# EAGLE design yamaHACK (EAGLE 8.2.1)
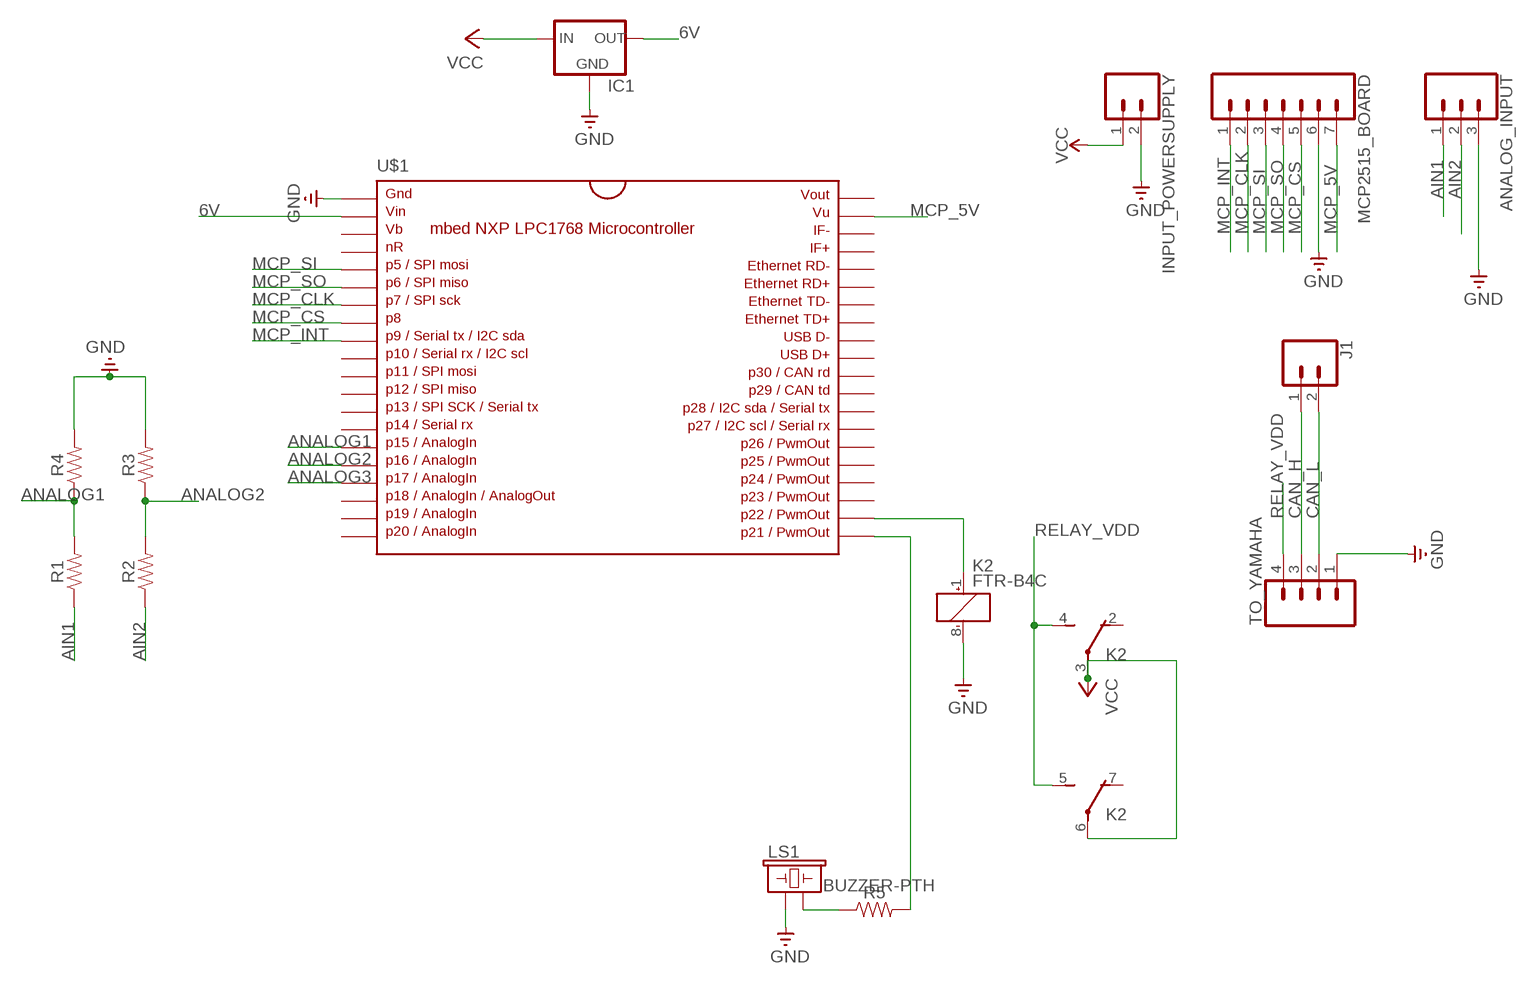
[diagram p0: schematic, sheet 1]

## Parts
ANALOG_INPUT  CONN_03LONGPADS  [1X03_LONGPADS]
IC1  78MXXS  [78MXXS]
INPUT_POWERSUPPLY  CONN_02PTH3  [1X02_LONGPADS]
J1  CONN_02  [1X02]
K2  FTR-B4C  [FTR-B4C]
LS1  BUZZER-PTH  [BUZZER-12MM]
MCP2515_BOARD  CONN_07LONGPADS  [1X07_LONGPADS]
R1  RESISTORAXIAL-0.3  [AXIAL-0.3]
R2  RESISTORAXIAL-0.3  [AXIAL-0.3]
R3  RESISTORAXIAL-0.3  [AXIAL-0.3]
R4  RESISTORAXIAL-0.3  [AXIAL-0.3]
R5  RESISTORAXIAL-0.3  [AXIAL-0.3]
TO_YAMAHA  CONN_04  [1X04]
U$1  MBED1768  MBED_NXP_LPC1768  [DIL40_0.9]

## Nets
6V: IC1.OUT U$1.2
AIN1: ANALOG_INPUT.1 R1.P$1
AIN2: ANALOG_INPUT.2 R2.P$1
ANALOG1: R1.P$2 R4.P$1 U$1.15
ANALOG2: R2.P$2 R3.P$1 U$1.16
ANALOG3: U$1.17
CAN_H: J1.1 TO_YAMAHA.3
CAN_L: J1.2 TO_YAMAHA.2
GND: ANALOG_INPUT.3 IC1.GND INPUT_POWERSUPPLY.2 K2.8(K:-) LS1.+ MCP2515_BOARD.6 R3.P$2 R4.P$2 TO_YAMAHA.1 U$1.1
MCP_5V: MCP2515_BOARD.7 U$1.39
MCP_CLK: MCP2515_BOARD.2 U$1.7
MCP_CS: MCP2515_BOARD.5 U$1.8
MCP_INT: MCP2515_BOARD.1 U$1.9
MCP_SI: MCP2515_BOARD.3 U$1.5
MCP_SO: MCP2515_BOARD.4 U$1.6
N$1: LS1.- R5.P$1
N$2: R5.P$2 U$1.21
N$13: K2.1(K:+) U$1.22
RELAY_VDD: K2.4(-1:S) K2.5(-2:S) TO_YAMAHA.4
VCC: IC1.IN INPUT_POWERSUPPLY.1 K2.3(-1:P) K2.6(-2:P)
Unconnected: K2.2(-1:O) K2.7(-2:O) U$1.3 U$1.4 U$1.10 U$1.11 U$1.12 U$1.13 U$1.14 U$1.18 U$1.19 U$1.20 U$1.23 U$1.24 U$1.25 U$1.26 U$1.27 U$1.28 U$1.29 U$1.30 U$1.31 U$1.32 U$1.33 U$1.34 U$1.35 U$1.36 U$1.37 U$1.38 U$1.40

## Library data of the parts
ANALOG_INPUT = SparkFun-Connectors:CONN_03: Multi connection point. Often used as Generic Header-pin footprint for 0.1 inch spaced/style header connections On any of the 0.1 inch spaced packages, you can populate with these: Break Away Headers - Straight <https://www.sparkfun.com/products/116> (PRT-00116) Break Away Male Headers - Right Angle <https://www.sparkfun.com/products/553> (PRT-00553) Female Headers <https://www.sparkfun.com/products/115> (PRT-00115) Break Away Headers - Machine Pin <https://www.sparkfun.com/products/117> (PRT-00117) Break Away Female Headers - Swiss Machine Pin <https://www.sparkfun.com/products/743> (PRT-00743) Stackable Header - 3 Pin (Female, 0.1") <https://www.sparkfun.com/products/13875> (PRT-13875) For SCREWTERMINALS and SPRING TERMINALS visit here: Screw Terimnals on SparkFun.com <https://www.sparkfun.com/search/results?term=Screw+Terminals> (5mm/3.5mm/2.54mm spacing) This device is also useful as a general connection point to wire up your design to another part of your project. Our various solder wires solder well into these plated through hole pads. Hook-Up Wire - Assortment (Stranded, 22 AWG) <https://www.sparkfun.com/products/11375> (PRT-11375) Hook-Up Wire - Assortment (Solid Core, 22 AWG) <https://www.sparkfun.com/products/11367> (PRT-11367) View the entire wire category on our website here <https://www.sparkfun.com/categories/141> Special notes: Molex polarized connector foot print use with SKU : PRT-08232 with associated crimp pins and housings.
IC1 = v-reg:78MXXS: VOLTAGE REGULATOR
INPUT_POWERSUPPLY J1 = SparkFun-Connectors:CONN_02: Multi connection point. Often used as Generic Header-pin footprint for 0.1 inch spaced/style header connections On any of the 0.1 inch spaced packages, you can populate with these: Break Away Headers - Straight <https://www.sparkfun.com/products/116> (PRT-00116) Break Away Male Headers - Right Angle <https://www.sparkfun.com/products/553> (PRT-00553) Female Headers <https://www.sparkfun.com/products/115> (PRT-00115) Break Away Headers - Machine Pin <https://www.sparkfun.com/products/117> (PRT-00117) Break Away Female Headers - Swiss Machine Pin <https://www.sparkfun.com/products/743> (PRT-00743) For SCREWTERMINALS and SPRING TERMINALS visit here: Screw Terimnals on SparkFun.com <https://www.sparkfun.com/search/results?term=Screw+Terminals> (5mm/3.5mm/2.54mm spacing) This device is also useful as a general connection point to wire up your design to another part of your project. Our various solder wires solder well into these plated through hole pads. Hook-Up Wire - Assortment (Stranded, 22 AWG) <https://www.sparkfun.com/products/11375> (PRT-11375) Hook-Up Wire - Assortment (Solid Core, 22 AWG) <https://www.sparkfun.com/products/11367> (PRT-11367) View the entire wire category on our website here <https://www.sparkfun.com/categories/141> Special notes: Molex polarized connector foot print use with: PRT-08233 with associated crimp pins and housings. 2.54_SCREWTERM for use with PRT-10571. 3.5mm Screw Terminal footprints for PRT-08084 5mm Screw Terminal footprints for use with PRT-08432
K2 = relay:FTR-B4: ULTRA MINIATURE RELAY 2 POLES - 2 A (Slim Profile Signal Relay) FUJITSU FTR-B4 SERIES Source: FTR-B4.pdf
LS1 = SparkFun-Electromechanical:BUZZER: Buzzer Small round buzzers that operate around the audible 2kHz range. You can use these as speakers to create simple music or user interfaces. Variant Overview: PTH - Mini Speaker - PC Mount 12mm 2.048kHz <https://www.sparkfun.com/products/7950> PTH_KIT - Mini Speaker - PC Mount 12mm 2.048kHz <https://www.sparkfun.com/products/7950> KIT simplifies soldering by adding stop mask to one side of the pads. PTH_NO_SILK - Mini Speaker - PC Mount 12mm 2.048kHz <https://www.sparkfun.com/products/7950> No silkscreen indicator of buzzer outline. PTH_KIT_NO_SILK - Mini Speaker - PC Mount 12mm 2.048kHz <https://www.sparkfun.com/products/7950> KIT package w/o silkscreen SMD - Buzzer Audio Magnetic (CCV-084B16) SMD buzzer used on, e.g. the LilyPad Buzzer <https://www.sparkfun.com/products/8463> and RFID USB Reader <https://www.sparkfun.com/products/9963>. SMD_KIT - Buzzer Audio Magnetic (CCV-084B16) SMD Buzzer with elongated pins to make soldering easier. Used on the SparkFun Simon Says - Surface Mount Soldering Kit <https://www.sparkfun.com/products/10935>.; PROD_ID: COMP-08253; SF_SKU: COM-07950
MCP2515_BOARD = SparkFun-Connectors:CONN_07: Multi connection point. Often used as Generic Header-pin footprint for 0.1 inch spaced/style header connections On any of the 0.1 inch spaced packages, you can populate with these: Break Away Headers - Straight <https://www.sparkfun.com/products/116> (PRT-00116) Break Away Male Headers - Right Angle <https://www.sparkfun.com/products/553> (PRT-00553) Female Headers <https://www.sparkfun.com/products/115> (PRT-00115) Break Away Headers - Machine Pin <https://www.sparkfun.com/products/117> (PRT-00117) Break Away Female Headers - Swiss Machine Pin <https://www.sparkfun.com/products/743> (PRT-00743) For SCREWTERMINALS and SPRING TERMINALS visit here: Screw Terimnals on SparkFun.com <https://www.sparkfun.com/search/results?term=Screw+Terminals> (5mm/3.5mm/2.54mm spacing) This device is also useful as a general connection point to wire up your design to another part of your project. Our various solder wires solder well into these plated through hole pads. Hook-Up Wire - Assortment (Stranded, 22 AWG) <https://www.sparkfun.com/products/11375> (PRT-11375) Hook-Up Wire - Assortment (Solid Core, 22 AWG) <https://www.sparkfun.com/products/11367> (PRT-11367) View the entire wire category on our website here <https://www.sparkfun.com/categories/141> Special notes: Molex polarized connector foot print use with SKU : PRT-08231 with associated crimp pins and housings. 1MM SMD Version SKU: PRT-10208 NOTES ON THE VARIANTS LOCK and LOCK_LONGPADS... This footprint was designed to help hold the alignment of a through-hole component (i.e. 6-pin header) while soldering it into place. You may notice that each hole has been shifted either up or down by 0.005 of an inch from it's more standard position (which is a perfectly straight line). This slight alteration caused the pins (the squares in the middle) to touch the edges of the holes. Because they are alternating, it causes a "brace" to hold the component in place. 0.005 has proven to be the perfect amount of "off-center" position when using our standard breakaway headers. Although looks a little odd when you look at the bare footprint, once you have a header in there, the alteration is very hard to notice. Also,if you push a header all the way into place, it is covered up entirely on the bottom side.
R1-R5 = SparkFun-Resistors:RESISTOR: Generic Resistor Package
TO_YAMAHA = SparkFun-Connectors:CONN_04: Multi connection point. Often used as Generic Header-pin footprint for 0.1 inch spaced/style header connections On any of the 0.1 inch spaced packages, you can populate with these: Break Away Headers - Straight <https://www.sparkfun.com/products/116> (PRT-00116) Break Away Male Headers - Right Angle <https://www.sparkfun.com/products/553> (PRT-00553) Female Headers <https://www.sparkfun.com/products/115> (PRT-00115) Break Away Headers - Machine Pin <https://www.sparkfun.com/products/117> (PRT-00117) Break Away Female Headers - Swiss Machine Pin <https://www.sparkfun.com/products/743> (PRT-00743) For SCREWTERMINALS and SPRING TERMINALS visit here: Screw Terimnals on SparkFun.com <https://www.sparkfun.com/search/results?term=Screw+Terminals> (5mm/3.5mm/2.54mm spacing) This device is also useful as a general connection point to wire up your design to another part of your project. Our various solder wires solder well into these plated through hole pads. Hook-Up Wire - Assortment (Stranded, 22 AWG) <https://www.sparkfun.com/products/11375> (PRT-11375) Hook-Up Wire - Assortment (Solid Core, 22 AWG) <https://www.sparkfun.com/products/11367> (PRT-11367) View the entire wire category on our website here <https://www.sparkfun.com/categories/141> Special notes: Molex polarized connector foot print use with SKU : PRT-08231 with associated crimp pins and housings. 1MM SMD Version SKU: PRT-10208; PROD_ID: CONN-09696
U$1 = SparkFun-Boards:MBED_NXP_LPC1768: mbed LPC1768 board footprint Boards using this footprint: mbed - LPC1768 (Cortex-M3) (DEV-09564); PROD_ID: COMP-12167

## Board
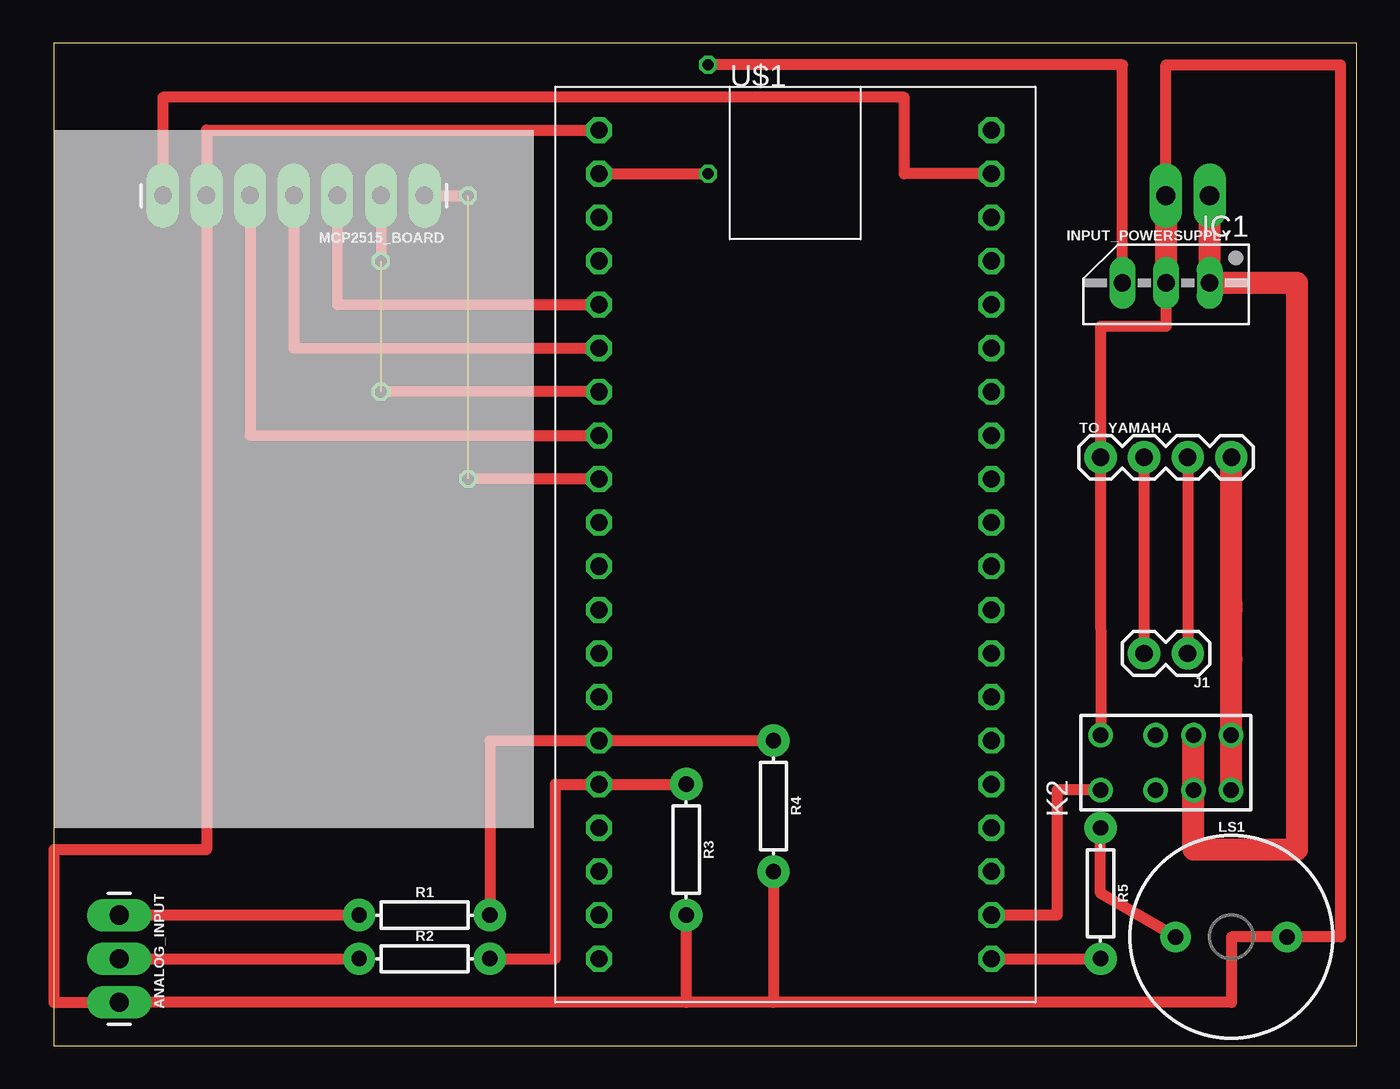
[diagram p1: board, top side]
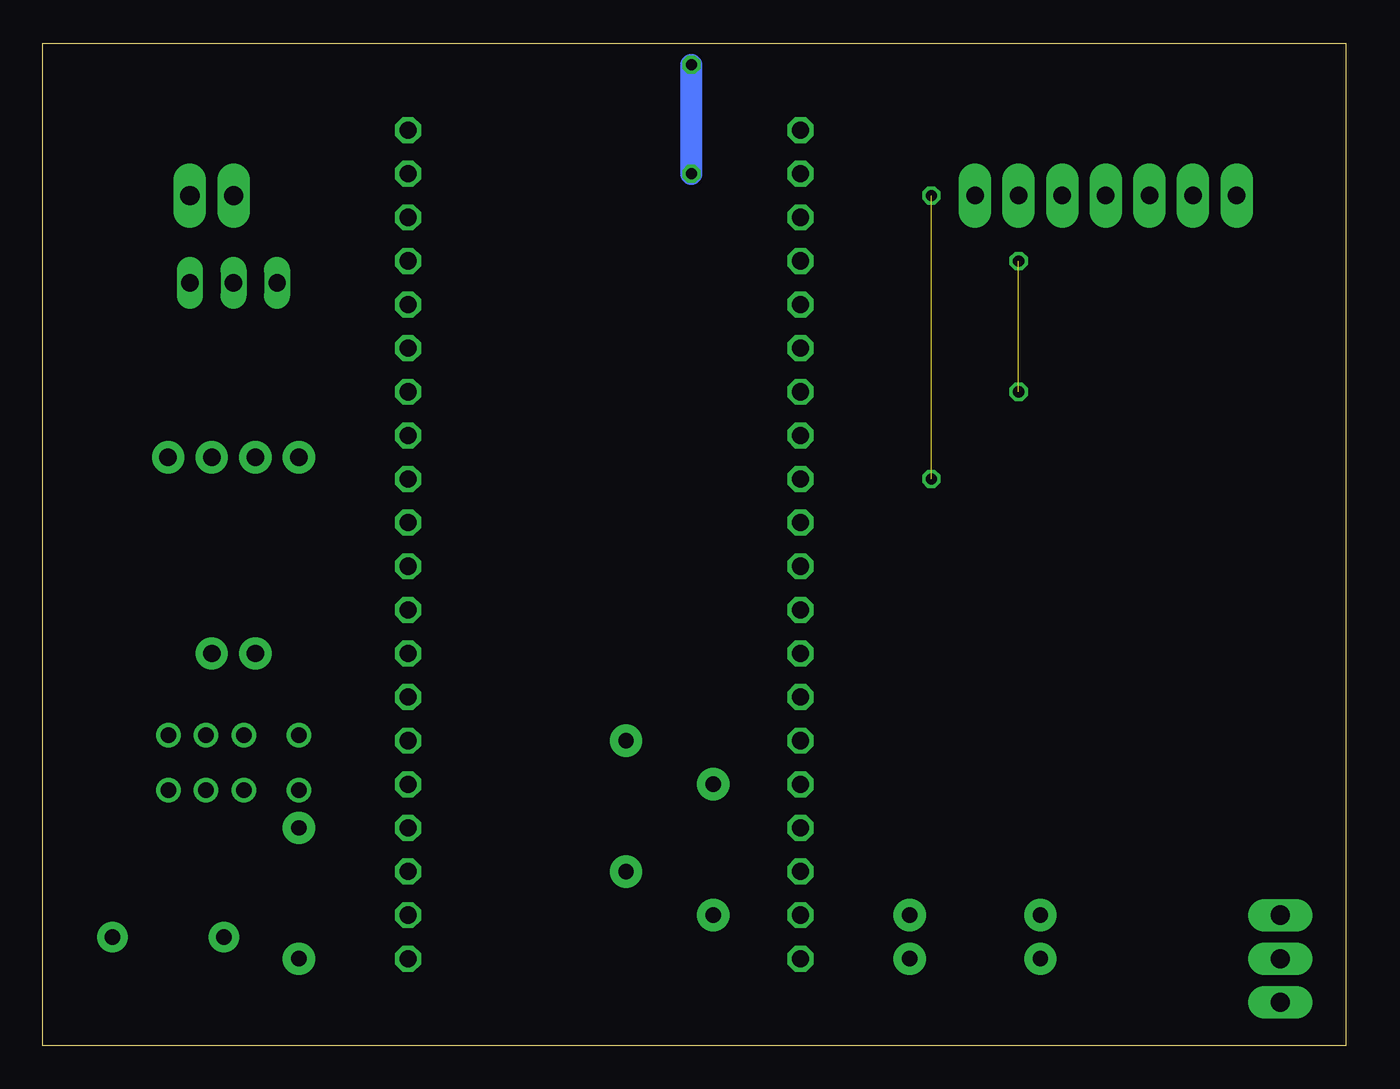
[diagram p2: board, bottom side, seen from below]

Size 75.87 x 58.41 mm. Coordinates in mm from the lower left corner, seen from the top.
Outline: 0,0 75.87,0 75.87,58.41 0,58.41 0,0
Copper layers (1*16): Top 0.035mm / dielectric 1.5mm / Bottom 0.035mm
Design rules "default": minimum track width 6mil, minimum drill 0.35mm, track to track 6mil, track to pad 6mil, pad to pad 6mil, via to via 6mil, smd to smd 6mil, copper to edge 40mil, drill to drill 6mil, minimum pad ring 10mil, minimum via ring 8mil, stop-mask expansion 4mil, vias tented up to drill 0mil, thermal gap 10mil

### Footprints (pad centres in the part's own frame; a part is rotated, then mirrored left to right if it is on the bottom)
1X03_LONGPADS = drill 1.118 pad 1.88 long: 1 0,0; 2 2.54,0; 3 5.08,0
78MXXS = drill 1.016 long: GND 0,-2.54; IN -2.54,-2.54; OUT 2.54,-2.54
1X02_LONGPADS = drill 1.118 pad 1.88 long: 1 0,0; 2 2.54,0
1X02 = drill 1.016 pad 1.88: 1 0,0; 2 2.54,0
FTR-B4C = drill 0.9 pad 1.422: 1 -3.8,-1.6; 2 -0.6,-1.6; 3 1.6,-1.6; 4 3.8,-1.6; 5 3.8,1.6; 6 1.6,1.6; 7 -0.6,1.6; 8 -3.8,1.6
BUZZER-12MM = drill 0.9 pad 1.778: + 3.25,0; - -3.25,0
1X07_LONGPADS = drill 1.016 pad 1.88 long: 1 0,0; 2 2.54,0; 3 5.08,0; 4 7.62,0; 5 10.16,0; 6 12.7,0; 7 15.24,0
AXIAL-0.3 = drill 0.9 pad 1.88: P$1 -3.81,0; P$2 3.81,0
1X04 = drill 1.016 pad 1.88: 1 0,0; 2 2.54,0; 3 5.08,0; 4 7.62,0
DIL40_0.9 = drill 1 pad 1.397 octagon: 1 -22.86,-11.43; 2 -20.32,-11.43; 3 -17.78,-11.43; 4 -15.24,-11.43; 5 -12.7,-11.43; 6 -10.16,-11.43; 7 -7.62,-11.43; 8 -5.08,-11.43; 9 -2.54,-11.43; 10 0,-11.43; 11 2.54,-11.43; 12 5.08,-11.43; 13 7.62,-11.43; 14 10.16,-11.43; 15 12.7,-11.43; 16 15.24,-11.43; 17 17.78,-11.43; 18 20.32,-11.43; 19 22.86,-11.43; 20 25.4,-11.43; 21 25.4,11.43; 22 22.86,11.43; 23 20.32,11.43; 24 17.78,11.43; 25 15.24,11.43; 26 12.7,11.43; 27 10.16,11.43; 28 7.62,11.43; 29 5.08,11.43; 30 2.54,11.43; 31 0,11.43; 32 -2.54,11.43; 33 -5.08,11.43; 34 -7.62,11.43; 35 -10.16,11.43; 36 -12.7,11.43; 37 -15.24,11.43; 38 -17.78,11.43; 39 -20.32,11.43; 40 -22.86,11.43

### Placement (x,y rotation side)
ANALOG_INPUT  3.81,7.62 270 top
IC1  64.77,41.91 180 top
INPUT_POWERSUPPLY  67.31,49.53 180 top
J1  66.04,22.86 180 top
K2  64.77,16.51 0 top
LS1  68.58,6.35 0 top
MCP2515_BOARD  21.59,49.53 180 top
R1  21.59,7.62 0 top
R2  21.59,5.08 0 top
R3  36.83,11.43 270 top
R4  41.91,13.97 270 top
R5  60.96,8.89 270 top
TO_YAMAHA  60.96,34.29 0 top
U$1  43.18,30.48 270 top

### Tracks (layer width: path | path; a pad name or v marks a point on that pad's centre or on a via)
6V  (via drill 0.65 pad 0.55)
  Top 0.635: IC1.OUT 62.23,57.15 v38.1,57.15 | U$1.2 v38.1,50.8
  Bottom 1.27: v38.1,50.8 v38.1,57.15
AIN1
  Top 0.635: R1.P$1 ANALOG_INPUT.1
AIN2
  Top 0.635: ANALOG_INPUT.2 R2.P$1
ANALOG1
  Top 0.635: R4.P$1 U$1.15 25.4,17.78 R1.P$2
ANALOG2
  Top 0.635: R3.P$1 U$1.16 29.21,15.24 29.21,5.08 R2.P$2
CAN_H
  Top 0.635: TO_YAMAHA.3 J1.1
CAN_L
  Top 0.635: J1.2 TO_YAMAHA.2
GND
  Top 0.635: K2.8 60.96,30.35 TO_YAMAHA.1 60.96,41.91 64.77,41.91 IC1.GND | U$1.1 8.89,53.34 MCP2515_BOARD.6 8.89,11.43 0,11.43 0,2.54 ANALOG_INPUT.3 36.83,2.54 | 41.91,2.54 36.83,2.54 | 41.91,2.54 68.58,2.54 68.58,6.35 LS1.+ 74.93,6.35 74.93,57.15 64.77,57.15 INPUT_POWERSUPPLY.2 | R3.P$2 36.83,2.54 | R4.P$2 41.91,2.54
  Top 1.27: INPUT_POWERSUPPLY.2 IC1.GND
MCP_5V
  Top 0.635: U$1.39 49.53,50.8 49.53,55.24 6.35,55.24 MCP2515_BOARD.7
MCP_CLK  (via drill 0.65 pad 0.9)  (1 unrouted)
  Top 0.635: MCP2515_BOARD.2 v19.05,45.72 | U$1.7 v19.05,38.1
MCP_CS
  Top 0.635: U$1.8 11.43,35.56 MCP2515_BOARD.5
MCP_INT  (via drill 0.65 pad 0.9)  (1 unrouted)
  Top 0.635: MCP2515_BOARD.1 v24.13,49.53 | U$1.9 v24.13,33.02
MCP_SI
  Top 0.635: U$1.5 16.51,43.18 MCP2515_BOARD.3
MCP_SO
  Top 0.635: MCP2515_BOARD.4 13.97,40.64 U$1.6
N$1
  Top 0.635: LS1.- 60.96,8.89 R5.P$1
N$2
  Top 0.635: U$1.21 R5.P$2
N$13
  Top 0.635: K2.1 58.42,14.91 58.42,7.62 U$1.22
RELAY_VDD
  Top 0.635: K2.4 K2.5 68.58,21.92 68.58,25.4 TO_YAMAHA.4
  Top 1.27: K2.4 68.58,22.53 68.58,25.4 | K2.5 68.58,25.73 TO_YAMAHA.4
VCC
  Top 1.27: K2.6 K2.3 66.37,11.43 72.39,11.43 72.39,44.45 IC1.IN INPUT_POWERSUPPLY.1